# Altium project Sitara_Project_Rev_A.PrjPcb (part 3 of 3)
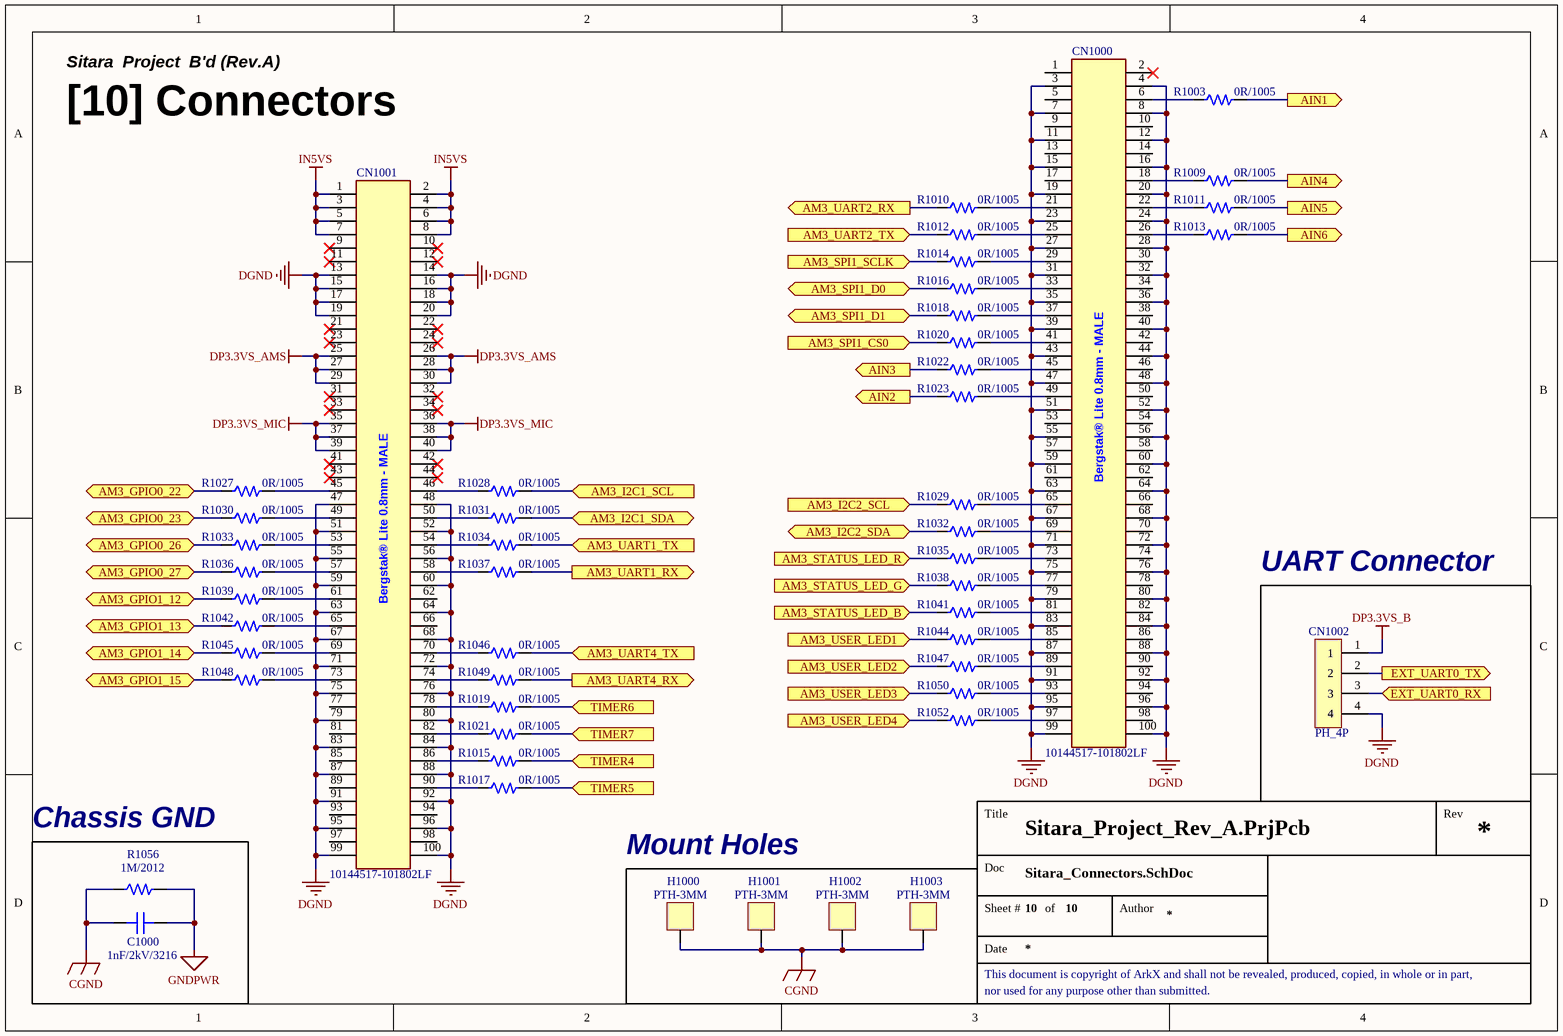
[diagram p10: Sitara_Connectors.SchDoc]

## Nets that join several sheets
CGND: Sitara_AUX (CN500.S1 CN500.S2), Sitara_IO_Bank_123 (CN700.10 CN700.11 CN700.12 CN700.13), Sitara_IO_Bank_45 (CN800.13 CN800.14), Sitara_IO_Bank_6 (CN900.S1 CN900.S2 CN900.S3 CN900.S4), Sitara_Connectors (6 pins)
DGND: Power (49 pins), Sitara_Power (117 pins), Sitara_AUX (17 pins), Sitara_DDR (51 pins), Sitara_IO_Bank_123 (32 pins), Sitara_IO_Bank_45 (35 pins), Sitara_IO_Bank_6 (29 pins), Sitara_Connectors (87 pins)
DP1.1V_CORE: Power (C325.2 R312.2), Sitara_Power (36 pins)
DP1.1V_MPU: Power (C324.2 R311.2), Sitara_Power (13 pins)
DP1.5V_DDR: Power (C323.2 R310.2), Sitara_Power (16 pins), Sitara_DDR (42 pins)
DP1.8V_VDDS: Power (R315.2), Sitara_Power (15 pins)
DP1.8V_VIO: Power (R313.2 U300.18), Sitara_IO_Bank_6 (U902.5)
DP1.8V_VRTC: Power (C326.2 R314.2 R327.2), Sitara_Power (C411.2 U400.D7), Sitara_AUX (C505.2 X501.1 X501.4)
DP1.8VS: Power (C328.2 R317.2), Sitara_Power (12 pins), Sitara_IO_Bank_123 (R717.2)
DP3.3VS_A: Power (6 pins), Sitara_Power (40 pins), Sitara_AUX (5 pins), Sitara_IO_Bank_123 (5 pins), Sitara_IO_Bank_45 (LED800.4), Sitara_IO_Bank_6 (5 pins)
DP3.3VS_AMS: Power (6 pins), Sitara_Connectors (6 pins)
DP3.3VS_B: Power (R336.2 R337.2), Sitara_AUX (R518.2), Sitara_IO_Bank_123 (19 pins), Sitara_IO_Bank_45 (10 pins), Sitara_IO_Bank_6 (11 pins), Sitara_Connectors (CN1002.1)
DP3.3VS_MIC: Power (5 pins), Sitara_Connectors (6 pins)
GNDADC: Sitara_Power (FB400.2 U400.E8), Sitara_AUX (C502.2 C503.2 C504.2 R545.2)
GNDOSC0: Sitara_Power (R400.1 U400.V11), Sitara_AUX (C501.1 X500.2)
GNDOSC1: Sitara_Power (R401.2 U400.A5), Sitara_AUX (C505.1 X501.2)
GNDPWR: Power (CN300.2 CN300.3 R309.1), Sitara_Connectors (C1000.2 R1056.2)
IN5VS: Power (10 pins), Sitara_Connectors (8 pins)
USB_5VS: Power (5 pins), Sitara_AUX (R500.1)
VDD_ADC: Sitara_Power (C409.2 FB402.2 U400.D8), Sitara_AUX (R541.2)
VDD_PLL: Sitara_Power (9 pins), Sitara_AUX (C501.2 X500.1 X500.4)
AIN1: Sitara_AUX (U400.C7), Sitara_Connectors (R1003.2)
AIN2: Sitara_AUX (U400.B7), Sitara_Connectors (R1023.1)
AIN3: Sitara_AUX (U400.A7), Sitara_Connectors (R1022.1)
AIN4: Sitara_AUX (U400.C8), Sitara_Connectors (R1009.2)
AIN5: Sitara_AUX (U400.B8), Sitara_Connectors (R1011.2)
AIN6: Sitara_AUX (U400.A8), Sitara_Connectors (R1013.2)
AM3_GPIO0_22: Sitara_IO_Bank_123 (U400.U10), Sitara_Connectors (R1027.1)
AM3_GPIO0_23: Sitara_IO_Bank_123 (U400.T10), Sitara_Connectors (R1030.1)
AM3_GPIO0_26: Sitara_IO_Bank_123 (U400.T11), Sitara_Connectors (R1033.1)
AM3_GPIO0_27: Sitara_IO_Bank_123 (U400.U12), Sitara_Connectors (R1036.1)
AM3_GPIO1_12: Sitara_IO_Bank_123 (U400.T12), Sitara_Connectors (R1039.1)
AM3_GPIO1_13: Sitara_IO_Bank_123 (U400.R12), Sitara_Connectors (R1042.1)
AM3_GPIO1_14: Sitara_IO_Bank_123 (U400.V13), Sitara_Connectors (R1045.1)
AM3_GPIO1_15: Sitara_IO_Bank_123 (U400.U13), Sitara_Connectors (R1048.1)
AM3_GPIO_ETH_PHY_RESET: Sitara_IO_Bank_45 (R837.1 U802.1), Sitara_IO_Bank_6 (U400.E18)
AM3_I2C0_SCL: Power (R322.2), Sitara_IO_Bank_123 (R700.1 U701.6), Sitara_IO_Bank_6 (U400.C16)
AM3_I2C0_SDA: Power (R323.2), Sitara_IO_Bank_123 (R701.1 U701.5), Sitara_IO_Bank_6 (U400.C17)
AM3_I2C1_SCL: Sitara_IO_Bank_6 (U400.A16), Sitara_Connectors (R1028.2)
AM3_I2C1_SDA: Sitara_IO_Bank_6 (U400.B16), Sitara_Connectors (R1031.2)
AM3_I2C2_SCL: Sitara_IO_Bank_6 (U400.D17), Sitara_Connectors (R1029.1)
AM3_I2C2_SDA: Sitara_IO_Bank_6 (U400.D18), Sitara_Connectors (R1032.1)
AM3_PMIC_LDO_PGOOD: Power (R329.2), Sitara_AUX (U400.B5)
AM3_PMIC_nINT: Power (R330.2), Sitara_IO_Bank_6 (U400.B18)
AM3_PMIC_nWAKEUP: Power (R332.2), Sitara_AUX (U400.C5)
AM3_PMIC_PGOOD: Power (R325.2), Sitara_IO_Bank_6 (U400.B15 U902.2)
AM3_PMIC_PWR_EN: Power (R324.2), Sitara_AUX (U400.C6)
AM3_SPI1_CS0: Sitara_IO_Bank_6 (U400.C12), Sitara_Connectors (R1020.1)
AM3_SPI1_D0: Sitara_IO_Bank_6 (U400.B13), Sitara_Connectors (R1016.1)
AM3_SPI1_D1: Sitara_IO_Bank_6 (U400.D12), Sitara_Connectors (R1018.1)
AM3_SPI1_SCLK: Sitara_IO_Bank_6 (U400.A13), Sitara_Connectors (R1014.1)
AM3_STATUS_LED_B: Sitara_IO_Bank_45 (R854.1), Sitara_IO_Bank_6 (U400.R5), Sitara_Connectors (R1041.1)
AM3_STATUS_LED_G: Sitara_IO_Bank_45 (R852.1), Sitara_IO_Bank_6 (U400.U5), Sitara_Connectors (R1038.1)
AM3_STATUS_LED_R: Sitara_IO_Bank_45 (R848.1), Sitara_IO_Bank_6 (U400.V5), Sitara_Connectors (R1035.1)
AM3_UART1_RX: Sitara_IO_Bank_6 (U400.D16), Sitara_Connectors (R1037.2)
AM3_UART1_TX: Sitara_IO_Bank_6 (U400.D15), Sitara_Connectors (R1034.2)
AM3_UART2_RX: Sitara_IO_Bank_6 (U400.A17), Sitara_Connectors (R1010.1)
AM3_UART2_TX: Sitara_IO_Bank_6 (U400.B17), Sitara_Connectors (R1012.1)
AM3_UART4_RX: Sitara_IO_Bank_123 (U400.T17), Sitara_Connectors (R1049.2)
AM3_UART4_TX: Sitara_IO_Bank_123 (U400.U17), Sitara_Connectors (R1046.2)
AM3_USER_LED1: Sitara_AUX (R544.1), Sitara_IO_Bank_123 (U400.V15), Sitara_Connectors (R1044.1)
AM3_USER_LED2: Sitara_AUX (R548.1), Sitara_IO_Bank_123 (U400.U15), Sitara_Connectors (R1047.1)
AM3_USER_LED3: Sitara_AUX (R552.1), Sitara_IO_Bank_123 (U400.T15), Sitara_Connectors (R1050.1)
AM3_USER_LED4: Sitara_AUX (R556.1), Sitara_IO_Bank_123 (U400.V16), Sitara_Connectors (R1052.1)
AM3_WARM_nRESET: Sitara_IO_Bank_45 (U802.2), Sitara_IO_Bank_6 (R910.2 U400.A10 U902.4)
EXT_UART0_RX: Sitara_IO_Bank_6 (R900.1 R904.2), Sitara_Connectors (CN1002.3)
EXT_UART0_TX: Sitara_IO_Bank_6 (R903.2), Sitara_Connectors (CN1002.2)
MMC0_CD: Sitara_IO_Bank_123 (R711.2), Sitara_IO_Bank_6 (U400.C15)
MMC0_CLK: Sitara_IO_Bank_123 (R710.1), Sitara_IO_Bank_45 (U400.G17)
MMC0_CMD: Sitara_IO_Bank_123 (R712.1), Sitara_IO_Bank_45 (U400.G18)
MMC0_DAT0: Sitara_IO_Bank_123 (R713.1), Sitara_IO_Bank_45 (U400.G16)
MMC0_DAT1: Sitara_IO_Bank_123 (R714.1), Sitara_IO_Bank_45 (U400.G15)
MMC0_DAT2: Sitara_IO_Bank_123 (R715.1), Sitara_IO_Bank_45 (U400.F18)
MMC0_DAT3: Sitara_IO_Bank_123 (R716.1), Sitara_IO_Bank_45 (U400.F17)
SYS_BOOT2: Sitara_AUX (R514.1 R517.2 R535.2), Sitara_IO_Bank_6 (U400.R3)
TIMER4: Sitara_IO_Bank_123 (U400.R7), Sitara_Connectors (R1015.2)
TIMER5: Sitara_IO_Bank_123 (U400.T6), Sitara_Connectors (R1017.2)
TIMER6: Sitara_IO_Bank_123 (U400.U6), Sitara_Connectors (R1019.2)
TIMER7: Sitara_IO_Bank_123 (U400.T7), Sitara_Connectors (R1021.2)